# EAGLE design Dual_Hbridge (EAGLE 9.6.0)
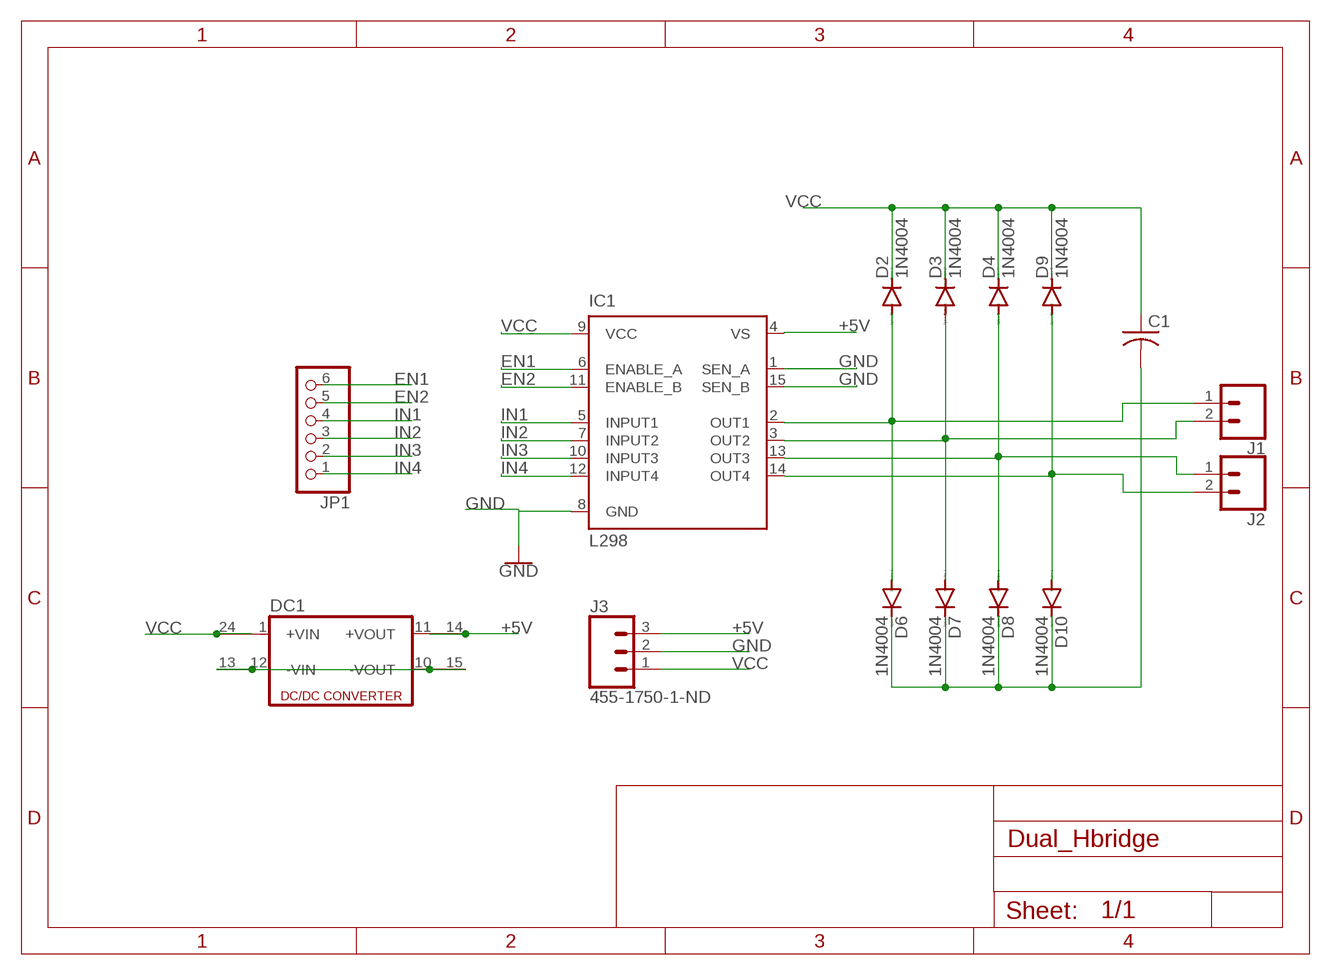
[diagram p0: schematic, sheet 1]

## Parts
C1  C-US025-024X044  [C025-024X044]
D2  1N4004  [DO41-10]
D3  1N4004  [DO41-10]
D4  1N4004  [DO41-10]
D6  1N4004  [DO41-10]
D7  1N4004  [DO41-10]
D8  1N4004  [DO41-10]
D9  1N4004  [DO41-10]
D10  1N4004  [DO41-10]
DC1  DC213R  [CMK]
IC1  L298  [MULTIWATT-15]
J1  CONN_02  [1X02]
J2  CONN_02  [1X02]
J3  455-1750-1-ND  CONN_03  [1X03]
JP1  PINHD-1X6  [1X06]

## Nets
+5V: DC1.11(+VOUT) DC1.14(+VOUT1) IC1.4(VS) J3.3
EN1: IC1.6(ENABLE_A) JP1.6
EN2: IC1.11(ENABLE_B) JP1.5
GND: IC1.1(SEN_A) IC1.8(GND) IC1.15(SEN_B) J3.2
IN1: IC1.5(INPUT1) JP1.4
IN2: IC1.7(INPUT2) JP1.3
IN3: IC1.10(INPUT3) JP1.2
IN4: IC1.12(INPUT4) JP1.1
N$2: C1.2 D6.C D7.C D8.C D10.C
N$3: D2.A D6.A IC1.2(OUT1) J1.1
N$4: D3.A D7.A IC1.3(OUT2) J1.2
N$5: D4.A D8.A IC1.13(OUT3) J2.1
N$6: D9.A D10.A IC1.14(OUT4) J2.2
N$13: DC1.10(-VOUT) DC1.12(-VIN) DC1.13(-VIN1) DC1.15(-VOUT1)
VCC: C1.1 D2.C D3.C D4.C D9.C DC1.1(+VIN) DC1.24(+VIN1) IC1.9(VCC) J3.1

## Library data of the parts
C1 = rcl:C-US: CAPACITOR, American symbol; SPICEPREFIX: C
D2-D4 D6-D10 = diode:1N4004: DIODE general purpose rectifier, 1 A
DC1 = dc-dc-converter:DC213R: DC-DC CONVERTER; OC_FARNELL: unknown; OC_NEWARK: unknown
IC1 = st-microelectronics:L298: DUAL FULL-BRIDGE DRIVER; MPN: L298N; OC_FARNELL: 1589425; OC_NEWARK: 32M1527
J1 J2 = SparkFun-Connectors:CONN_02: Multi connection point. Often used as Generic Header-pin footprint for 0.1 inch spaced/style header connections On any of the 0.1 inch spaced packages, you can populate with these: Break Away Headers - Straight <https://www.sparkfun.com/products/116> (PRT-00116) Break Away Male Headers - Right Angle <https://www.sparkfun.com/products/553> (PRT-00553) Female Headers <https://www.sparkfun.com/products/115> (PRT-00115) Break Away Headers - Machine Pin <https://www.sparkfun.com/products/117> (PRT-00117) Break Away Female Headers - Swiss Machine Pin <https://www.sparkfun.com/products/743> (PRT-00743) For SCREWTERMINALS and SPRING TERMINALS visit here: Screw Terimnals on SparkFun.com <https://www.sparkfun.com/search/results?term=Screw+Terminals> (5mm/3.5mm/2.54mm spacing) This device is also useful as a general connection point to wire up your design to another part of your project. Our various solder wires solder well into these plated through hole pads. Hook-Up Wire - Assortment (Stranded, 22 AWG) <https://www.sparkfun.com/products/11375> (PRT-11375) Hook-Up Wire - Assortment (Solid Core, 22 AWG) <https://www.sparkfun.com/products/11367> (PRT-11367) View the entire wire category on our website here <https://www.sparkfun.com/categories/141> Special notes: Molex polarized connector foot print use with: PRT-08233 with associated crimp pins and housings. 2.54_SCREWTERM for use with PRT-10571. 3.5mm Screw Terminal footprints for PRT-08084 5mm Screw Terminal footprints for use with PRT-08432
J3 = SparkFun-Connectors:CONN_03: Multi connection point. Often used as Generic Header-pin footprint for 0.1 inch spaced/style header connections On any of the 0.1 inch spaced packages, you can populate with these: Break Away Headers - Straight <https://www.sparkfun.com/products/116> (PRT-00116) Break Away Male Headers - Right Angle <https://www.sparkfun.com/products/553> (PRT-00553) Female Headers <https://www.sparkfun.com/products/115> (PRT-00115) Break Away Headers - Machine Pin <https://www.sparkfun.com/products/117> (PRT-00117) Break Away Female Headers - Swiss Machine Pin <https://www.sparkfun.com/products/743> (PRT-00743) Stackable Header - 3 Pin (Female, 0.1") <https://www.sparkfun.com/products/13875> (PRT-13875) For SCREWTERMINALS and SPRING TERMINALS visit here: Screw Terimnals on SparkFun.com <https://www.sparkfun.com/search/results?term=Screw+Terminals> (5mm/3.5mm/2.54mm spacing) This device is also useful as a general connection point to wire up your design to another part of your project. Our various solder wires solder well into these plated through hole pads. Hook-Up Wire - Assortment (Stranded, 22 AWG) <https://www.sparkfun.com/products/11375> (PRT-11375) Hook-Up Wire - Assortment (Solid Core, 22 AWG) <https://www.sparkfun.com/products/11367> (PRT-11367) View the entire wire category on our website here <https://www.sparkfun.com/categories/141> Special notes: Molex polarized connector foot print use with SKU : PRT-08232 with associated crimp pins and housings.; PROD_ID: XXX-00000
JP1 = pinhead:PINHD-1X6: PIN HEADER

## Board
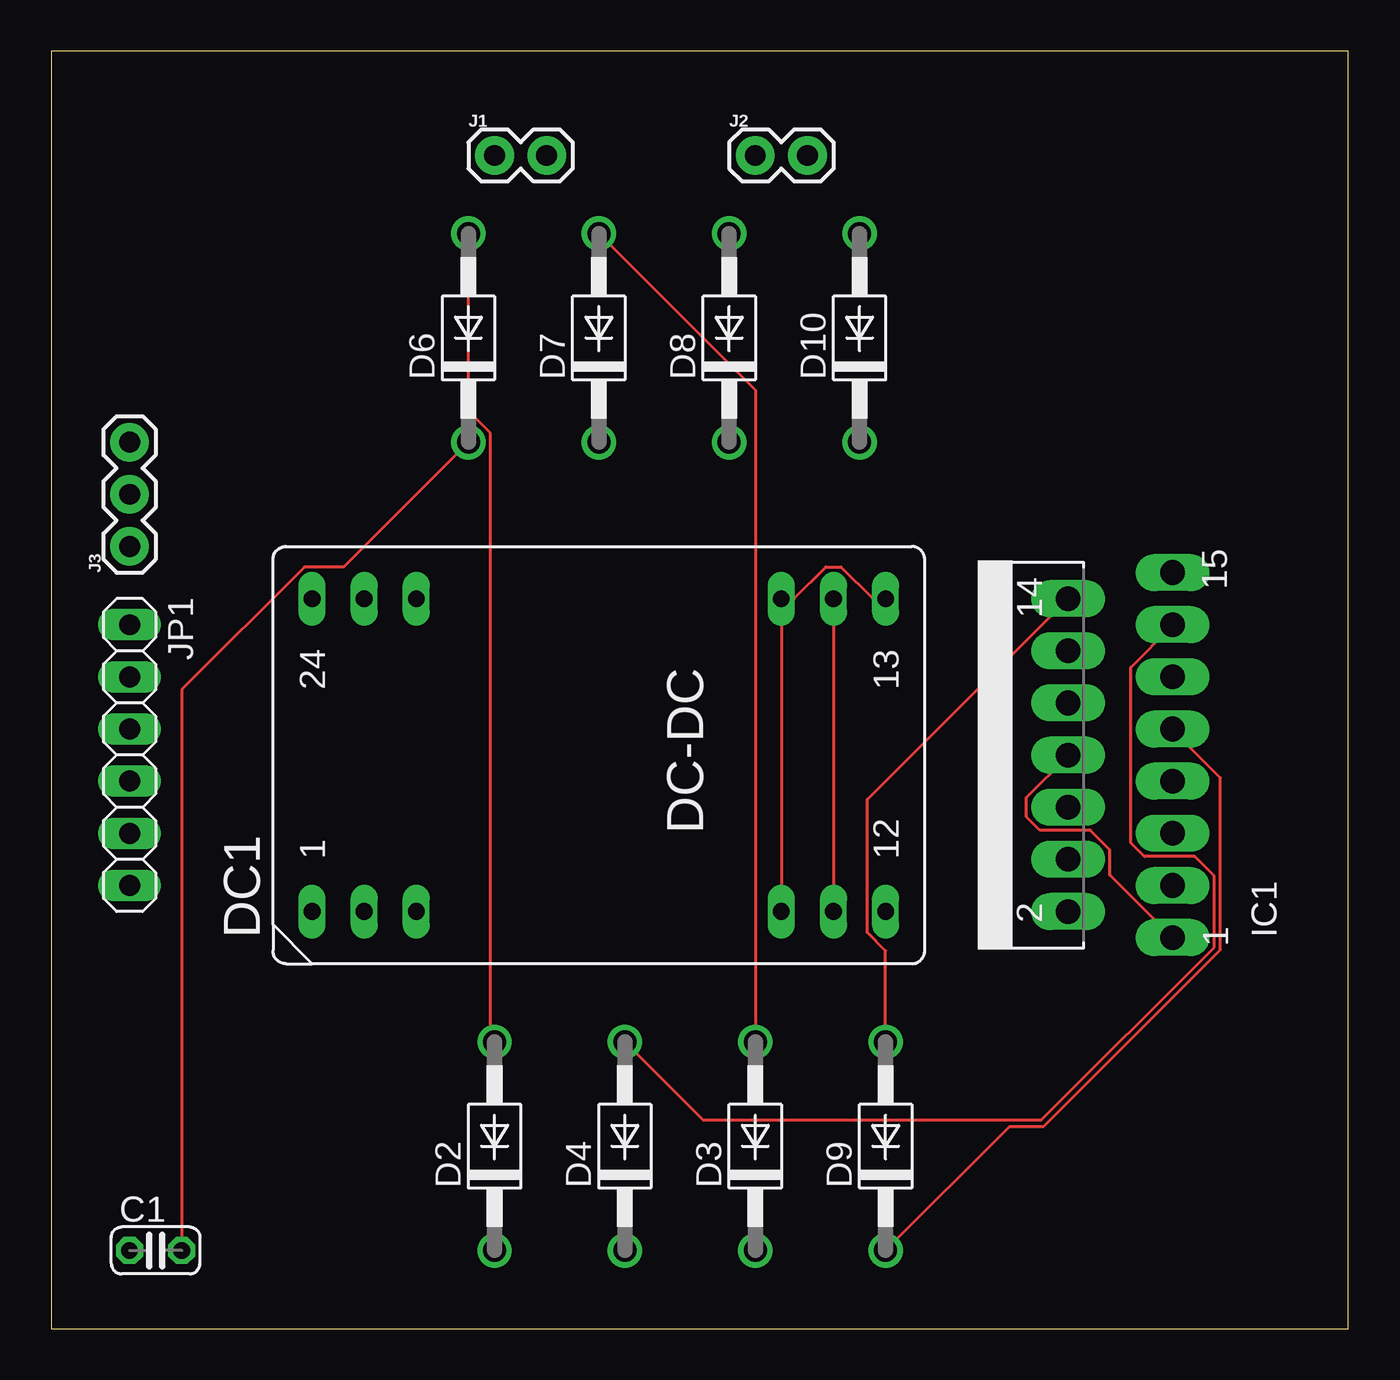
[diagram p1: board, top side]
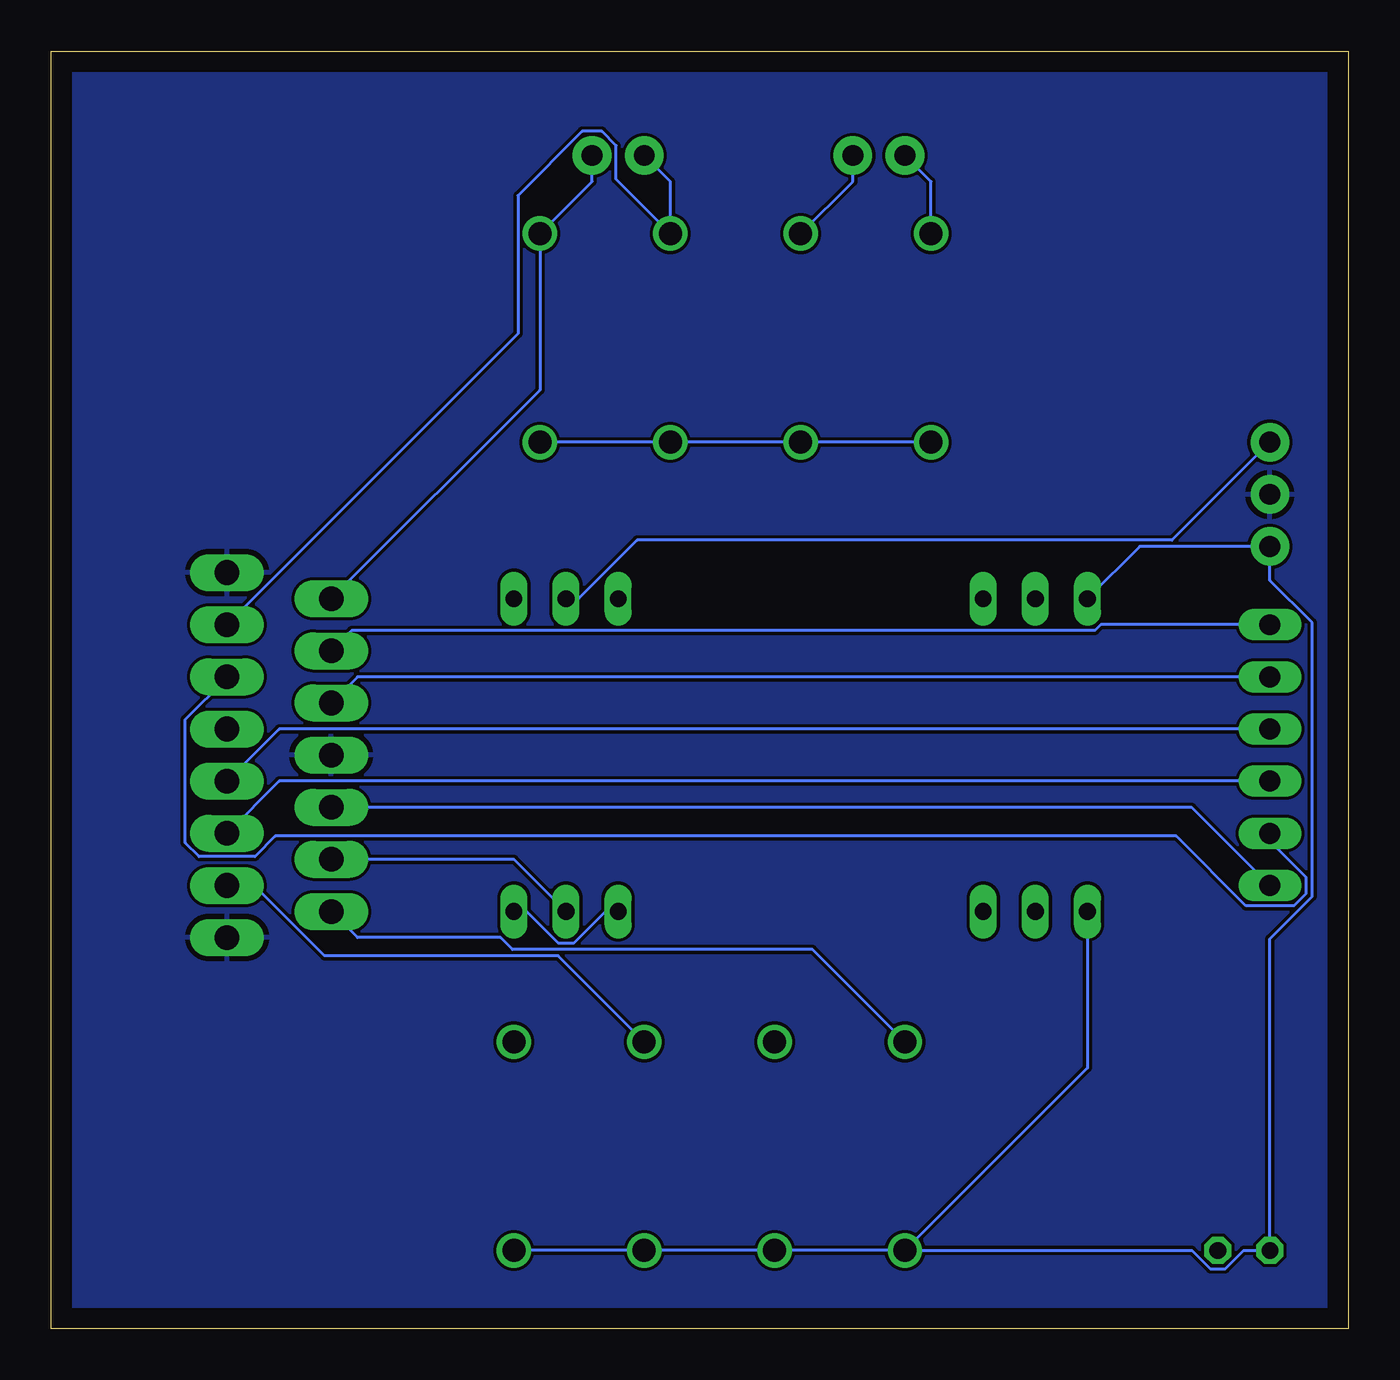
[diagram p2: board, bottom side, seen from below]

Size 63.17 x 62.22 mm. Coordinates in mm from the lower left corner, seen from the top.
Outline: 0,0 63.17,0 63.17,62.22 0,62.22 0,0
Copper layers (1*16): Top 0.035mm / dielectric 1.5mm / Bottom 0.035mm
Design rules "default": minimum track width 6mil, minimum drill 0.35mm, track to track 6mil, track to pad 6mil, pad to pad 6mil, via to via 6mil, smd to smd 6mil, copper to edge 40mil, drill to drill 6mil, minimum pad ring 10mil, minimum via ring 8mil, stop-mask expansion 4mil, vias tented up to drill 0mil, thermal gap 10mil

### Footprints (pad centres in the part's own frame; a part is rotated, then mirrored left to right if it is on the bottom)
C025-024X044 = drill 0.813 octagon: 1 -1.27,0; 2 1.27,0
DO41-10 = drill 1.118: A 5.08,0; C -5.08,0
CMK = drill 0.813 long: 1 -7.62,13.97; 2 -7.62,11.43; 3 -7.62,8.89; 10 -7.62,-8.89; 11 -7.62,-11.43; 12 -7.62,-13.97; 13 7.62,-13.97; 14 7.62,-11.43; 15 7.62,-8.89; 22 7.62,8.89; 23 7.62,11.43; 24 7.62,13.97
MULTIWATT-15 = drill 1.2 long: 1 -8.89,-7.62; 2 -7.62,-2.54; 3 -6.35,-7.62; 4 -5.08,-2.54; 5 -3.81,-7.62; 6 -2.54,-2.54; 7 -1.27,-7.62; 8 0,-2.54; 9 1.27,-7.62; 10 2.54,-2.54; 11 3.81,-7.62; 12 5.08,-2.54; 13 6.35,-7.62; 14 7.62,-2.54; 15 8.89,-7.62
1X02 = drill 1.016 pad 1.88: 1 0,0; 2 2.54,0
1X03 = drill 1.016 pad 1.88: 1 0,0; 2 2.54,0; 3 5.08,0
1X06 = drill 1.016 long: 1 -6.35,0; 2 -3.81,0; 3 -1.27,0; 4 1.27,0; 5 3.81,0; 6 6.35,0

### Placement (x,y rotation side)
C1  5.08,3.81 0 top
D2  21.59,8.89 90 top
D3  34.29,8.89 90 top
D4  27.94,8.89 90 top
D6  20.32,48.26 90 top
D7  26.67,48.26 90 top
D8  33.02,48.26 90 top
D9  40.64,8.89 90 top
D10  39.37,48.26 90 top
DC1  26.67,27.94 90 top
IC1  46.99,27.94 90 top
J1  21.59,57.15 0 top
J2  34.29,57.15 0 top
J3  3.81,38.1 90 top
JP1  3.81,27.94 270 top

### Tracks (layer width: path | path; a pad name or v marks a point on that pad's centre or on a via)
+5V
  Top 0.152: DC1.14 DC1.11
  Bottom 0.152: J3.3 8.59,38.41 34.63,38.41 37.48,35.56 DC1.14 | DC1.11 40.64,22.86 IC1.4
EN1
  Bottom 0.152: JP1.6 7.62,25.4 IC1.6
EN2
  Bottom 0.152: JP1.5 3.81,23.75 2.06,22 2.06,21.18 2.64,20.6 4.98,20.6 8.37,23.99 52.26,23.99 53.24,23 55.98,23 56.64,23.66 56.64,29.68 54.61,31.71 IC1.11
GND
  Top 0.152: IC1.1 51.56,22.1 51.56,23.33 50.62,24.27 48.16,24.27 47.5,24.93 47.5,25.87 49.53,27.9 IC1.8
  pour Bottom: 0,62.23 0,0 63.5,0 63.5,62.23
IN1
  Bottom 0.152: JP1.4 52.07,26.67 IC1.5
IN2
  Bottom 0.152: JP1.3 52.07,29.21 IC1.7
IN3
  Bottom 0.152: JP1.2 48.26,31.75 IC1.10
IN4
  Bottom 0.152: JP1.1 12.05,34.29 12.33,34.01 48.54,34.01 IC1.12
N$2
  Top 0.152: D6.C 14.25,37.11 12.33,37.11 6.35,31.13 C1.2
  Bottom 0.152: D6.C D7.C D8.C D10.C
N$3
  Top 0.152: D6.A 20.32,44.69 21.39,43.62 21.39,14.17 D2.A
  Bottom 0.152: D6.A 20.32,55.88 J1.1 | D2.A 26.09,18.47 40.7,18.47 41.29,19.05 48.26,19.05 IC1.2
N$4
  Top 0.152: D7.A 34.29,45.72 D3.A
  Bottom 0.152: D7.A 24.13,55.88 J1.2 | D3.A 38.48,18.16 49.87,18.16 53.3,21.59 IC1.3
N$5
  Top 0.152: D4.A 31.75,10.16 48.22,10.16 56.64,18.58 56.64,22.06 55.7,23 53.24,23 52.58,23.66 52.58,32.22 54.61,34.25 IC1.13
  Bottom 0.152: 53.3,34.29 IC1.13 40.44,48.46 40.44,55.2 37.31,58.32 36.35,58.32 35.66,57.63 35.66,55.98 D8.A 33.02,55.88 J2.1
N$6
  Top 0.152: D9.A 40.64,18.4 39.75,19.29 39.75,25.78 IC1.14
  Bottom 0.152: J2.2 36.83,55.88 D10.A 39.37,45.72 IC1.14
N$13
  Top 0.152: DC1.13 40.02,35.56 38.47,37.11 37.73,37.11 36.18,35.56 DC1.15 DC1.10
  Bottom 0.152: DC1.10 36.18,20.32 37.73,18.77 38.47,18.77 40.02,20.32 DC1.12
VCC
  Top 0.152: D9.C 46.69,9.86 48.34,9.86 56.94,18.46 56.94,26.83 54.61,29.17 IC1.9
  Bottom 0.152: DC1.24 10.16,38.1 J3.1 3.81,36.45 1.75,34.4 1.75,21.05 3.81,19 C1.1 5.09,3.81 5.98,2.92 6.72,2.92 7.61,3.81 D2.C | D2.C D4.C D3.C D9.C | DC1.1 12.7,12.7 D2.C